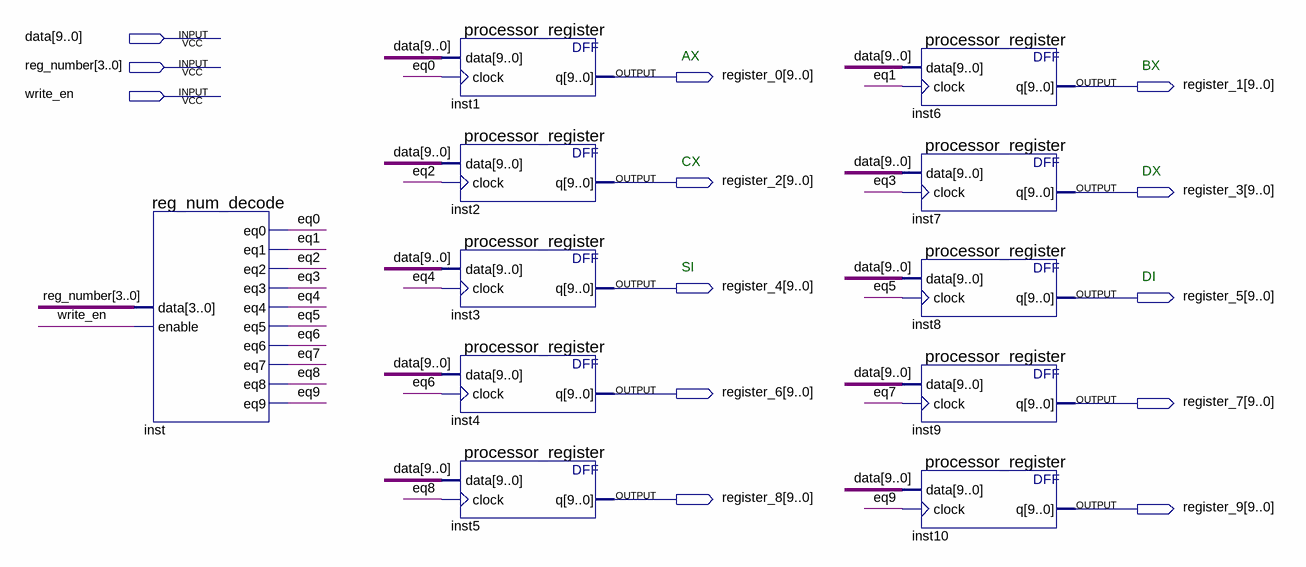
[diagram p0: schematic sheet]
// Quartus schematic RON.bdf as structural Verilog: 11 symbols, 13 pins
module RON (
  input  [9:0] data,
  input  [3:0] reg_number,
  input  write_en,
  output [9:0] register_0,
  output [9:0] register_1,
  output [9:0] register_2,
  output [9:0] register_3,
  output [9:0] register_4,
  output [9:0] register_5,
  output [9:0] register_6,
  output [9:0] register_7,
  output [9:0] register_8,
  output [9:0] register_9
);

  wire eq0, eq1, eq2, eq3, eq4, eq5, eq6, eq7, eq8, eq9;

  reg_num_decode inst (
    .data(reg_number), .enable(write_en), .eq0(eq0), .eq1(eq1), .eq2(eq2), .eq3(eq3), .eq4(eq4), .eq5(eq5),
    .eq6(eq6), .eq7(eq7), .eq8(eq8), .eq9(eq9));
  processor_register inst1 (.data(data), .clock(eq0), .q(register_0));
  processor_register inst2 (.data(data), .clock(eq2), .q(register_2));
  processor_register inst3 (.data(data), .clock(eq4), .q(register_4));
  processor_register inst4 (.data(data), .clock(eq6), .q(register_6));
  processor_register inst5 (.data(data), .clock(eq8), .q(register_8));
  processor_register inst6 (.data(data), .clock(eq1), .q(register_1));
  processor_register inst7 (.data(data), .clock(eq3), .q(register_3));
  processor_register inst8 (.data(data), .clock(eq5), .q(register_5));
  processor_register inst9 (.data(data), .clock(eq7), .q(register_7));
  processor_register inst10 (.data(data), .clock(eq9), .q(register_9));

  // Notes on the sheet:
  //   AX
  //   BX
  //   CX
  //   DX
  //   SI
  //   DI
endmodule
